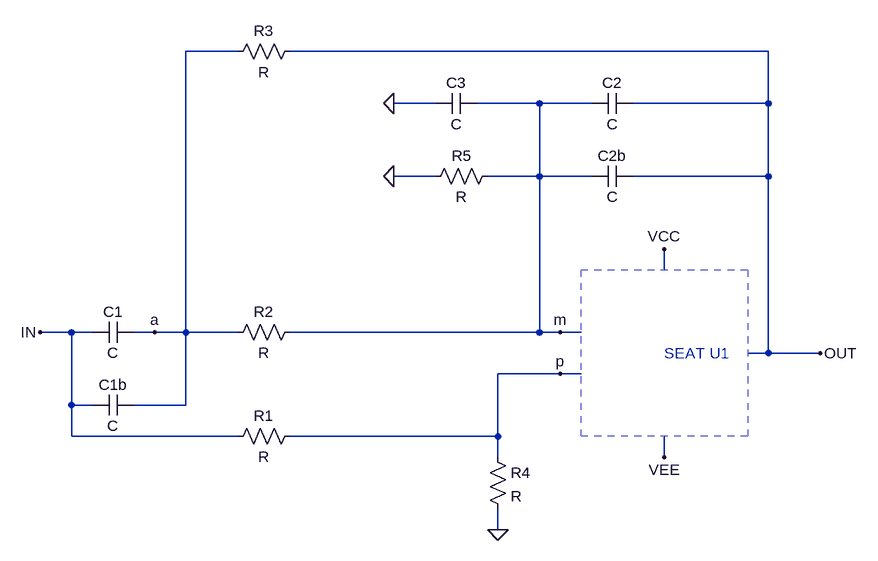
[diagram p0: schematic MFB_N.asc]
MFB_N.asc, the LTspice schematic file:
Version 4.1
SHEET 1 2076 680
WIRE -400 -208 -480 -208
WIRE 416 -208 -320 -208
WIRE -96 -128 -160 -128
WIRE 64 -128 -32 -128
WIRE 144 -128 64 -128
WIRE 416 -128 416 -208
WIRE 416 -128 208 -128
WIRE -96 -16 -160 -16
WIRE 64 -16 64 -128
WIRE 64 -16 -16 -16
WIRE 144 -16 64 -16
WIRE 416 -16 416 -128
WIRE 416 -16 208 -16
WIRE 256 128 256 96
WIRE -656 224 -704 224
WIRE -624 224 -656 224
WIRE -528 224 -560 224
WIRE -480 224 -480 -208
WIRE -480 224 -528 224
WIRE -400 224 -480 224
WIRE 64 224 64 -16
WIRE 64 224 -320 224
WIRE 96 224 64 224
WIRE 128 224 96 224
WIRE 416 256 416 -16
WIRE 416 256 384 256
WIRE 496 256 416 256
WIRE 96 288 0 288
WIRE 128 288 96 288
WIRE -656 336 -656 224
WIRE -624 336 -656 336
WIRE -480 336 -480 224
WIRE -480 336 -560 336
WIRE -656 384 -656 336
WIRE -400 384 -656 384
WIRE 0 384 0 288
WIRE 0 384 -320 384
WIRE 0 416 0 384
WIRE 256 416 256 384
WIRE 0 528 0 496
FLAG 496 256 OUT
FLAG 256 96 VCC
FLAG 256 416 VEE
FLAG 96 224 m
FLAG 96 288 p
FLAG -528 224 a
FLAG -704 224 IN
FLAG -160 -16 0
FLAG 0 528 0
FLAG -160 -128 0
SYMBOL res -304 368 R90
WINDOW 0 0 56 VBottom 2
WINDOW 3 32 56 VTop 2
SYMATTR InstName R1
SYMBOL res -304 -224 R90
WINDOW 0 0 56 VBottom 2
WINDOW 3 32 56 VTop 2
SYMATTR InstName R3
SYMBOL res -16 400 R0
SYMATTR InstName R4
SYMBOL res 0 -32 R90
WINDOW 0 0 56 VBottom 2
WINDOW 3 32 56 VTop 2
SYMATTR InstName R5
SYMBOL res -304 208 R90
WINDOW 0 0 56 VBottom 2
WINDOW 3 32 56 VTop 2
SYMATTR InstName R2
SYMBOL cap -560 208 R90
WINDOW 0 0 32 VBottom 2
WINDOW 3 32 32 VTop 2
SYMATTR InstName C1
SYMBOL cap 208 -144 R90
WINDOW 0 0 32 VBottom 2
WINDOW 3 32 32 VTop 2
SYMATTR InstName C2
SYMBOL cap -560 320 R90
WINDOW 3 32 32 VTop 2
WINDOW 0 0 32 VBottom 2
SYMATTR InstName C1b
SYMBOL cap 208 -32 R90
WINDOW 0 0 32 VBottom 2
WINDOW 3 32 32 VTop 2
SYMATTR InstName C2b
SYMBOL cap -32 -144 R90
WINDOW 0 0 32 VBottom 2
WINDOW 3 32 32 VTop 2
SYMATTR InstName C3
TEXT 256 256 Left 2 ;SEAT U1
RECTANGLE Normal 128 128 384 384 2

The netlist it stands for:
* MFB_N.asc
R1 p IN R
R3 OUT a R
R4 p 0 R
R5 m 0 R
R2 m a R
C1 a IN C
C2 OUT m C
C1b a IN C
C2b OUT m C
C3 m 0 C
* SEAT U1
.backanno
.end